# EAGLE design Bertha_v4_5 (EAGLE 8.0.1)
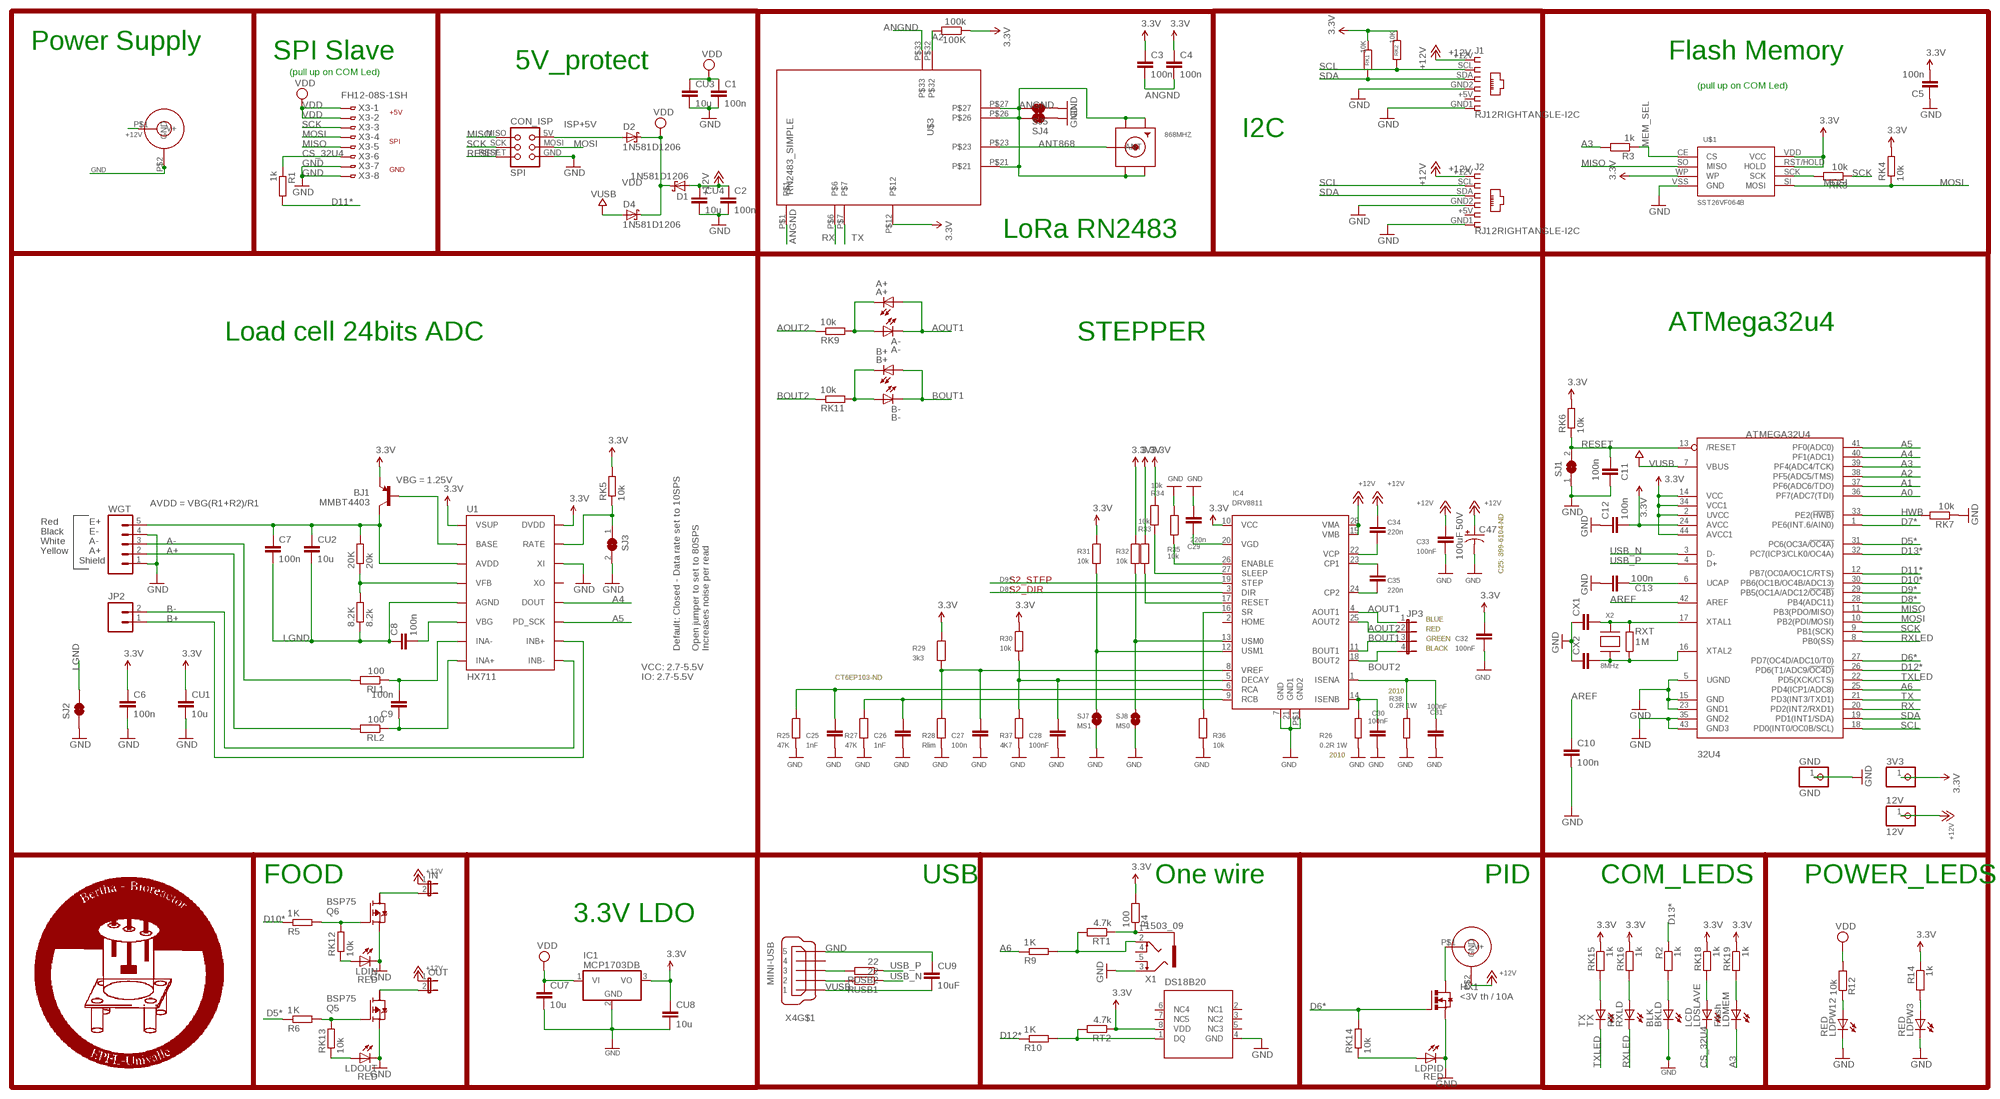
[diagram p0: schematic, sheet 1]

## Parts
3V3  PINHD-1X1  [1X01]
8.2K  8.2k  R-EU_M0805  [M0805]
12V  12V  PINHD-1X1  [1X01]
20K  20k  R-EU_M0805  [M0805]
32U4  ATMEGA32U4  ATMEGA32U4-AU  [TQFP44]
100K  100k  R-EU_R0805  [R0805]
868MHZ  SMACONNECTOR_EDGE  [SMA_EDGELAUNCH]
A+  A+  LEDCHIP-LED0805  [CHIP-LED0805]
A-  A-  LEDCHIP-LED0805  [CHIP-LED0805]
B+  B+  LEDCHIP-LED0805  [CHIP-LED0805]
B-  B-  LEDCHIP-LED0805  [CHIP-LED0805]
BJ1  MMBT4403  TRANSISTOR_PNPMMBT4403  [SOT23-3]
BKLD  BLK  LEDCHIP-LED0805  [CHIP-LED0805]
C1  100n  C-EUC0805  [C0805]
C2  100n  C-EUC0805  [C0805]
C3  100n  C-EUC0805  [C0805]
C4  100n  C-EUC0805  [C0805]
C5  100n  C-EUC0805  [C0805]
C6  100n  C-EUC0805  [C0805]
C7  100n  C-EUC0805  [C0805]
C8  100n  C-EUC0805  [C0805]
C9  100n  C-EUC0805  [C0805]
C10  100n  C-EUC0805  [C0805]
C11  100n  C-EUC0805  [C0805]
C12  100n  C-EUC0805  [C0805]
C13  100n  C-EUC0805  [C0805]
C25  1nF  CAP0805  [0805]
C26  1nF  CAP0805  [0805]
C27  100n  CAP0805  [0805]
C28  100nF  CAP0805  [0805]
C29  220n  CAP0805  [0805]
C30  100nF  CAP0805  [0805]
C31  100nF  CAP0805  [0805]
C32  100nF  CAP0805  [0805]
C33  100nF  CAP0805  [0805]
C34  220n  CAP0805  [0805]
C35  220n  CAP0805  [0805]
C47  100uF 50V  CAP_POLE  [PANASONIC_E]
CON1  JACK_DC_BARREL  [DC_BARREL]
CON2  JACK_DC_BARREL  [DC_BARREL]
CON_ISP  SPI  TINYISPT  [TC2030-MCP-NL]
CU1  10u  C-EUC0805  [C0805]
CU2  10u  C-EUC0805  [C0805]
CU3  10u  C-EUC0805  [C0805]
CU4  10u  C-EUC0805  [C0805]
CU7  10u  C-EUC0805  [C0805]
CU8  10u  C-EUC0805  [C0805]
CU9  10uF  C-EUC0805  [C0805]
CX1  22pF  C-EUC0805  [C0805]
CX2  22pF  C-EUC0805  [C0805]
D1  1N581D1206  [LED-1206]
D2  1N581D1206  [LED-1206]
D4  1N581D1206  [LED-1206]
GND  GND  PINHD-1X1  [1X01]
HX1  <3V th / 10A  IRF3704S  [D2PACK]
IC1  MCP1703DB  [SOT223]
IC4  DRV8811  [HTSSOP28]
IN  JP1E  [JP1]
J1  RJ12RIGHTANGLE-I2C  [RJ12-RIGHTANGLE-I2C]
J2  RJ12RIGHTANGLE-I2C  [RJ12-RIGHTANGLE-I2C]
JP2  M02PTH  [1X02]
JP3  JP4E  [JP4]
LDIN  RED  LEDCHIP-LED0805  [CHIP-LED0805]
LDMEM  Flash  LEDCHIP-LED0805  [CHIP-LED0805]
LDOUT  RED  LEDCHIP-LED0805  [CHIP-LED0805]
LDPID  RED  LEDCHIP-LED0805  [CHIP-LED0805]
LDPW3  RED  LEDCHIP-LED0805  [CHIP-LED0805]
LDPW12  RED  LEDCHIP-LED0805  [CHIP-LED0805]
LDSLAVE  LCD  LEDCHIP-LED0805  [CHIP-LED0805]
OUT  JP1E  [JP1]
Q5  BSP75  BSP613P  [PG-SOT-223]
Q6  BSP75  BSP613P  [PG-SOT-223]
R1  1k  R-EU_R0805  [R0805]
R2  1k  R-EU_R0805  [R0805]
R3  1k  R-EU_R0805  [R0805]
R4  100  R-EU_R0805  [R0805]
R5  1K  R-EU_R0805  [R0805]
R6  1K  R-EU_R0805  [R0805]
R9  1K  R-EU_R0805  [R0805]
R10  1K  R-EU_R0805  [R0805]
R12  10k  R-EU_R0805  [R0805]
R14  1k  R-EU_R0805  [R0805]
R25  47K  RESISTOR0805  [0805]
R26  0.2R 1W  R-EU_R2010  [R2010]
R27  47K  RESISTOR0805  [0805]
R28  Rlim  RESISTOR0805  [0805]
R29  3k3  RESISTOR0805  [0805]
R30  10k  RESISTOR0805  [0805]
R31  10k  RESISTOR0805  [0805]
R32  10k  RESISTOR0805  [0805]
R33  10k  RESISTOR0805  [0805]
R34  10k  RESISTOR0805  [0805]
R35  10k  RESISTOR0805  [0805]
R36  10k  RESISTOR0805  [0805]
R37  4K7  RESISTOR0805  [0805]
R38  0.2R 1W  R-EU_R2010  [R2010]
RK1  10K  R-EU_M0805  [M0805]
RK2  10K  R-EU_M0805  [M0805]
RK3  10k  R-EU_R0805  [R0805]
RK4  10k  R-EU_R0805  [R0805]
RK5  10k  R-EU_M0805  [M0805]
RK6  10k  R-EU_M0805  [M0805]
RK7  10k  R-EU_M0805  [M0805]
RK9  10k  R-EU_R0805  [R0805]
RK11  10k  R-EU_R0805  [R0805]
RK12  10k  R-EU_R0805  [R0805]
RK13  10k  R-EU_R0805  [R0805]
RK14  10k  R-EU_R0805  [R0805]
RK15  1k  R-EU_R0805  [R0805]
RK16  1k  R-EU_R0805  [R0805]
RK18  1k  R-EU_R0805  [R0805]
RK19  1k  R-EU_R0805  [R0805]
RL1  100  R-EU_M0805  [M0805]
RL2  100  R-EU_M0805  [M0805]
RT1  4.7k  R-EU_R0805  [R0805]
RT2  4.7k  R-EU_R0805  [R0805]
RUSB1  22  R-EU_M0805  [M0805]
RUSB2  22  R-EU_M0805  [M0805]
RXLD  RX  LEDCHIP-LED0805  [CHIP-LED0805]
RXT  1M  R-EU_R0805  [R0805]
SJ1  SJ  [SJ]
SJ2  JUMPER-PAD-2-NC_BY_TRACE  [PAD-JUMPER-2-NC_BY_TRACE_YES_SILK]
SJ3  SJ  [SJ]
SJ4  JUMPER-PAD-2-NC_BY_TRACE  [PAD-JUMPER-2-NC_BY_TRACE_YES_SILK]
SJ5  JUMPER-PAD-2-NC_BY_TRACE  [PAD-JUMPER-2-NC_BY_TRACE_YES_SILK]
SJ7  MS1  SJ  [SJ]
SJ8  MS0  SJ  [SJ]
TX  TX  LEDCHIP-LED0805  [CHIP-LED0805]
U1  HX711  HX711HX711  [SO16]
U$1  SST26VF064B  SST25VF064C  [SOIC_8-LEAD]
U$2  DS18B20  DS18B20SMALL  [MSOP8]
U$3  RN2483_SIMPLE  [RN2483_SIMPLE]
WGT  M05PTH  [1X05]
X1  1503_09  [1503_09]
X2  8MHz  XTALNX6035  [NX6035]
X3  FH12-08S-1SH  [FH12-08S-1SH]
X4  MINI-USB  MINI-USB-SCHIELD-32005-201  [32005-201]

## Nets
3.3V [power]: 3V3.1 32U4.2(UVCC) 32U4.14(VCC) 32U4.24(AVCC) 32U4.34(VCC1) 32U4.44(AVCC1) 100K.1 BJ1.2(E) C3.1 C4.1 C5.2 C6.1 C12.2 C32.1 CU1.1 CU8.1 IC1.3(VO) IC4.10(VCC) R4.2 R14.1 R29.2 R30.2 R31.2 R32.2 R33.2 R34.2 RK1.1 RK2.1 RK4.2 RK5.2 RK6.2 RK15.1 RK16.1 RK18.1 RK19.1 RT2.1 U1.1(VSUP) U1.16(DVDD) U$1.RST/HOLD(HOLD) U$1.VDD(VCC) U$1.WP U$2.8(VDD) U$3.P$12
+12V [power]: 12V.1 C2.1 C33.1 C34.1 C47.+ CON1.P$1(V+) CON2.P$2(GND) CU4.1 D1.A IC4.15(VMB) IC4.28(VMA) IN.1 J1.+12V J2.+12V OUT.1
A0: 32U4.36(PF7(ADC7(TDI))
A1: 32U4.37(PF6(ADC6/TDO))
A2: 32U4.38(PF5(ADC5/TMS)) 100K.2 U$3.P$32
A3: 32U4.39(PF4(ADC4/TCK)) LDMEM.C R3.2
A4: 32U4.40(PF1(ADC1)) U1.12(DOUT)
A5: 32U4.41(PF0(ADC0)) U1.11(PD_SCK)
A6: 32U4.25(PD4(ICP1/ADC8)) R9.1
A+: RL2.2 WGT.2
A-: RL1.2 WGT.3
ANGND: 868MHZ.GND@1(GND4) 868MHZ.GND@2(GND3) 868MHZ.GND@3(GND2) 868MHZ.GND@4(GND1) C3.2 C4.2 SJ4.2 SJ5.2 U$3.P$1 U$3.P$21 U$3.P$26 U$3.P$27 U$3.P$33
ANT868: 868MHZ.P(ANT) U$3.P$23
AOUT1: A+.A A-.C IC4.4(AOUT1) JP3.1
AOUT2: IC4.25(AOUT2) JP3.2 RK9.1
AREF: 32U4.42(AREF) C10.1
B+: JP2.1 U1.10(INB+)
B-: JP2.2 U1.9(INB-)
BOUT1: B+.A B-.C IC4.11(BOUT1) JP3.3
BOUT2: IC4.18(BOUT2) JP3.4 RK11.1
CN3: C8.2 U1.6(VBG)
CS_32U4: LDSLAVE.C R1.1 X3.6
D5*: 32U4.31(PC6(OC3A/!OC4A)) R6.1
D6*: 32U4.27(PD7(OC4D/ADC10/T0)) HX1.1(G) RK14.2
D7*: 32U4.1(PE6(INT.6/AIN0))
D8*: 32U4.28(PB4(ADC11)) IC4.3(DIR)
D9*: 32U4.29(PB5(OC1A/ADC12/!OC4B)) IC4.19(STEP)
D10*: 32U4.30(PB6(OC1B/OC4B/ADC13)) R5.1
D11*: 32U4.12(PB7(OC0A/OC1C/RTS)) R1.2
D12*: 32U4.26(PD6(T1/ADC9/!OC4D)) R10.1
D13*: 32U4.32(PC7(ICP3/CLK0/OC4A)) R2.1
GND [power]: 32U4.5(UGND) 32U4.15(GND) 32U4.23(GND1) 32U4.35(GND2) 32U4.43(GND3) BKLD.C C1.2 C2.2 C5.1 C6.2 C10.2 C11.2 C12.1 C13.1 C25.2 C26.2 C27.2 C28.2 C29.2 C30.2 C31.2 C32.2 C33.2 C47.- CON1.P$2(GND) CON_ISP.GND CU1.2 CU3.2 CU4.2 CU7.2 CU8.2 CU9.1 CX1.1 CX2.1 GND.1 HX1.3(S) IC1.2(GND) IC4.7(GND) IC4.21(GND1) IC4.P$1(GND2) J1.GND1 J1.GND2 J2.GND1 J2.GND2 LDIN.C LDOUT.C LDPID.C LDPW3.C LDPW12.C Q5.3(S) Q6.3(S) R25.1 R26.1 R27.1 R28.1 R35.1 R36.1 R37.1 R38.1 RK7.1 SJ1.1 SJ2.1 SJ3.2 SJ4.1 SJ5.1 SJ7.1 SJ8.1 U1.14(XI) U$1.VSS(GND) U$2.4(GND) WGT.1 WGT.4 X1.3 X3.7 X3.8 X4.5
HWB: 32U4.33(PE2(!HWB)) RK7.2
ISP+5V: CON_ISP.5V(VCC) D2.A
LGND: 8.2K.1 C7.2 C8.1 CU2.2 SJ2.2 U1.5(AGND)
MEM_SEL: R3.1 U$1.CE(CS)
MISO: 32U4.11(PB3(PDO/MISO)) CON_ISP.MISO U$1.SO(MISO) X3.5
MOSI: 32U4.10(PB2(PDI/MOSI)) CON_ISP.MOSI RK4.1 U$1.SI(MOSI) X3.4
N$1: 32U4.6(UCAP) C13.2
N$2: CON2.P$1(V+) HX1.2(D)
N$3: BKLD.A R2.2
N$5: 20K.2 BJ1.3(C) C7.1 CU2.1 U1.3(AVDD) WGT.5
N$7: LDPW12.A R12.1
N$8: Q6.1(G) R5.2 RK12.2
N$9 [power]: R10.2 RT2.2 U$2.1(DQ)
N$11: Q5.1(G) R6.2 RK13.2
N$12: C35.2 IC4.24(CP2)
N$13: OUT.2 Q5.2(D)
N$14 [power]: R4.1 RT1.1 X1.1
N$15: A+.C A-.A RK9.2
N$17: IN.2 Q6.2(D)
N$18: RK15.2 TX.A
N$19: B+.C B-.A RK11.2
N$20: C9.2 RL1.1 U1.7(INA-)
N$21 [power]: R9.2 RT1.2 X1.2
N$22: LDSLAVE.A RK18.2
N$23: RK3.2 U$1.SCK
N$24: RK16.2 RXLD.A
N$25: LDMEM.A RK19.2
N$26 [power]: LDPID.A RK14.1
N$27: LDIN.A RK12.1
N$28: LDOUT.A RK13.1
N$29: C35.1 IC4.23(CP1)
N$30: C34.2 IC4.22(VCP)
N$34: LDPW3.A R14.2
N$35: C29.1 IC4.20(VGD)
N$36: C31.1 IC4.1(ISENA) R38.2
N$38: BJ1.1(B) U1.2(BASE)
N$39: 8.2K.2 20K.1 U1.4(VFB)
N$40: C30.1 IC4.14(ISENB) R26.2
N$41: RK5.1 SJ3.1 U1.15(RATE)
N$42: 32U4.17(XTAL1) CX1.2 RXT.2 X2.P$2
N$43: C9.1 RL2.1 U1.8(INA+)
N$44: C28.1 IC4.5(DECAY) R30.1 R37.2
N$45: C25.1 IC4.6(RCA) R25.2
N$46: C26.1 IC4.9(RCB) R27.2
N$47: IC4.27(SLEEP) R34.1
N$48: IC4.17(RESET) R33.1
N$49: C27.1 IC4.8(VREF) R28.2 R29.1
N$50: IC4.26(ENABLE) R35.2
N$51: IC4.12(USM1) R31.1 SJ7.2
N$53: IC4.13(USM0) R32.1 SJ8.2
N$54: IC4.16(SR) R36.2
RESET: 32U4.13(/RESET) C11.1 CON_ISP.RESET RK6.1 SJ1.2
RX: 32U4.20(PD2(INT2/RXD1)) U$3.P$6
RXLED: 32U4.8(PB0(SS)) RXLD.C
SCK: 32U4.9(PB1(SCK)) CON_ISP.SCK RK3.1 X3.3
SCL: 32U4.18(PD0(INT0/OC0B/SCL)) J1.SCL J2.SCL RK2.2
SDA: 32U4.19(PD1(INT1/SDA)) J1.SDA J2.SDA RK1.2
TX: 32U4.21(PD3(INT3/TXD1)) U$3.P$7
TXLED: 32U4.22(PD5(XCK/CTS)) TX.C
USB_N: 32U4.3(D-) RUSB1.1
USB_P: 32U4.4(D+) RUSB2.1
USBC_N: RUSB1.2 X4.2
USBC_P: RUSB2.2 X4.3
VDD [power]: C1.1 CU3.1 CU7.1 D1.C D2.C D4.C IC1.1(VI) R12.2 X3.1 X3.2
VUSB: 32U4.7(VBUS) CU9.2 D4.A X4.1
XTAL1: 32U4.16(XTAL2) CX2.2 RXT.1 X2.P$1
Unconnected: IC4.2(HOME) Q5.4(D) Q6.4(D) U1.13(XO) U$2.2(NC1) U$2.3(NC2) U$2.5(NC3) U$2.6(NC4) U$2.7(NC5) X1.4 X1.5 X4.4 X4.M1(S:S1) X4.M2(S:S2) X4.M3(S:S3) X4.M4(S:S4)

## Notes on the sheet
- Power Supply
- SPI Slave | Flash Memory
- 5V_protect
- (pull up on COM Led)
- (pull up on COM Led)
- +5V
- I2C
- SPI
- GND
- LoRa RN2483
- ATMega32u4
- Load cell 24bits ADC | STEPPER
- VBG = 1.25V
- AVDD = VBG(R1+R2)/R1
- Red | E+
- Black | E-
- White | A-
- Yellow | A+
- Shield
- C25: 399-6104-ND
- S2_STEP
- S2_DIR
- BLUE
- RED
- GREEN
- Default: Closed - Data rate set to 10SPS
- Open jumper to set to 80SPS
  Increases noise per read
- BLACK
- VCC: 2.7-5.5V
- IO: 2.7-5.5V | CT6EP103-ND
- 2010
- 2010
- FOOD | USB | One wire | PID | COM_LEDS | POWER_LEDS
- 3.3V LDO

## Power pins joined to a net without a drawn wire
5: J1.+5V J2.+5V

## Library data of the parts
3V3 12V GND = Headerlibrary:PINHD-1X1: PIN HEADER
8.2K 20K R14 RK1 RK2 RK5-RK7 RL1 RL2 RT1 RT2 RUSB1 RUSB2 = resistor:R-EU_: RESISTOR, European symbol
32U4 = adafruit:ATMEGA32U4: http://www.ladyada.net/library/eagle
100K R1-R6 R9 R10 R12 R26 R38 RK3 RK4 RK9 RK11-RK16 RK18 RK19 RXT = rcl:R-EU_: RESISTOR, European symbol
868MHZ = sma_end_launch:SMACONNECTOR: SMA Connector 90° DIP SMA Connector, 50 Ohm (4UConnector: 07259)
A+ A- B+ B- BKLD LDIN LDMEM LDOUT LDPID LDPW3 LDPW12 LDSLAVE RXLD TX = adafruit:LED: LED OSRAM: - CHIPLED LG R971, LG N971, LY N971, LG Q971, LY Q971, LO R971, LY R971 LH N974, LH R974 LS Q976, LO Q976, LY Q976 LO Q996 - Hyper CHIPLED LW Q18S LB Q993, LB Q99A, LB R99A - SideLED LS A670, LO A670, LY A670, LG A670, LP A670 LB A673, LV A673, LT A673, LW A673 LH A674 LY A675 LS A676, LA A676, LO A676, LY A676, LW A676 LS A679, LY A679, LG A679 - Hyper Micro SIDELED® LS Y876, LA Y876, LO Y876, LY Y876 LT Y87S - SmartLED LW L88C, LW L88S LB L89C, LB L89S, LG L890 LS L89K, LO L89K, LY L89K LS L896, LA L896, LO L896, LY L896 - TOPLED LS T670, LO T670, LY T670, LG T670, LP T670 LSG T670, LSP T670, LSY T670, LOP T670, LYG T670 LG T671, LOG T671, LSG T671 LB T673, LV T673, LT T673, LW T673 LH T674 LS T676, LA T676, LO T676, LY T676, LB T676, LH T676, LSB T676, LW T676 LB T67C, LV T67C, LT T67C, LS T67K, LO T67K, LY T67K, LW E67C LS E67B, LA E67B, LO E67B, LY E67B, LB E67C, LV E67C, LT E67C LW T67C LS T679, LY T679, LG T679 LS T770, LO T770, LY T770, LG T770, LP T770 LB T773, LV T773, LT T773, LW T773 LH T774 LS E675, LA E675, LY E675, LS T675 LS T776, LA T776, LO T776, LY T776, LB T776 LHGB T686 LT T68C, LB T68C - Hyper Mini TOPLED® LB M676 - Mini TOPLED Santana® LG M470 LS M47K, LO M47K, LY M47K Source: http://www.osram.convergy.de/
BJ1 = SparkFun-DiscreteSemi:TRANSISTOR_PNP: Generic PNP BJT Double check pinouts against datasheets- not all devices are the same! MMBT3906 - 40V 200mA SOT-23 (TRANS-08052) MMBT4403 - 40V 600mA SOT-23 (TRANS-09245); PROD_ID: TRANS-09245
C1-C13 CU1-CU4 CU7-CU9 CX1 CX2 = rcl:C-EU: CAPACITOR, European symbol
C25-C35 = freetronics-master-v1:CAP: Capacitor Standard 0603 ceramic capacitor, and 0.1" leaded capacitor.
C47 = freetronics-original:CAP_POL: Capacitor Polarized These are standard SMD and PTH capacitors. Normally 10uF, 47uF, and 100uF in electrolytic and tantalum varieties. Always verify the external diameter of the through hole cap, it varies with capacity, voltage, and manufacturer. The EIA devices should be standard.
CON1 CON2 = lpatiny:JACK_DC_BARREL
CON_ISP = lpatiny:TINYISP: CONNECTOR
D1 D2 D4 = lpatiny:1N581*: 1.0A SCHOTTKY BARRIER RECTIFIER Source: http://www.diodes.com/datasheets/ds23001.pdf
HX1 = transistor-power:IRF3704: SMPS MOSFET HEXFET® Power MOSFET Source: http://www.irf.com/product-info/datasheets/data/irf3704.pdf
IC1 = linear:MCP1703: 250 mA, 16V, Low Quiescent Current LDO Regulator Source: http://ww1.microchip.com/downloads/en/DeviceDoc/22049b.pdf
IC4 = eje-components:DRV8811
IN OUT = jumper:JP1E: JUMPER
J1 J2 = lpatiny:RJ12: CORCOM Modular RJ Jacks No Shield Source: www.tycoelectronics.com .. ENG_DS_1654001_1099_RJ_L_0507.pdf
JP2 = SparkFun-Connectors:M02: Standard 2-pin 0.1" header. Use with - straight break away headers ( PRT-00116) - right angle break away headers (PRT-00553) - swiss pins (PRT-00743) - machine pins (PRT-00117) - female headers (PRT-00115) Molex polarized connector foot print use with: PRT-08233 with associated crimp pins and housings. 2.54_SCREWTERM for use with PRT-10571. 3.5mm Screw Terminal footprints for PRT-08084 5mm Screw Terminal footprints for use with PRT-08432
JP3 = jumper:JP4E: JUMPER
Q5 Q6 = infineon:BSP613P: SIPMOS (R) Small-Signal-Transistor P-Channel (2 Drain) Source: http://www.infineon.com/dgdl/BSP613P_Rev2.4.pdf; OC_FARNELL: unknown; OC_NEWARK: unknown
R25 R27-R37 = freetronics-master-v1:RESISTOR: Resistor Basic schematic elements and footprints for 0603, 1206, and PTH 1/10th watt (small) resistors.
SJ1 SJ3 = jumper:SJ: SMD solder JUMPER
SJ2 SJ4 SJ5 = SparkFun-Passives:JUMPER-PAD-2-NC_BY_TRACE
SJ7 SJ8 = freetronics-luke:SJ: PCB "solder jumper". Note that there should nothing on the BOM corresponding to this "component".
U1 = Testing:HX711; PROD_ID: IC-12445
U$1 = BertaLib:SST25VF064C
U$2 = lpatiny:DS18B20
U$3 = Octanis1_bioreactorPort:RN2483_SIMPLE
WGT = SparkFun-Connectors:M05: Header 5 Standard 5-pin 0.1" header. Use with straight break away headers (SKU : PRT-00116), right angle break away headers (PRT-00553), swiss pins (PRT-00743), machine pins (PRT-00117), and female headers (PRT-00115). Molex polarized connector foot print use with SKU : PRT-08230 with associated crimp pins and housings.
X1 = con-lumberg:1503_09: Jack connectors according to JISC 6560, 3.5 mm Klinkeneinbaukupplung nach JISC 6560, 3,5 mm, 3-polig/ stereo, abgewinkelte Ausführung, mit 2 Öffnern und Lötaugen, für Leiterplatten Rückseitenmontage Source: http://www.lumberg.com/Produkte/PDFs/1503_09.pdf; OC_FARNELL: 1243244; OC_NEWARK: unknown
X2 = lpatiny:XTAL: Low cost SMT crystals, no capacitors included http://www.ladyada.net/library/eagle
X3 = con-hirose:FH12-08S-1S: 1mm Pitch Connectors For FPC/FFC Source: Data sheet <http://www.hirose.co.jp/cataloge_hp/e58605370.pdf>; OC_FARNELL: unknown; OC_NEWARK: unknown
X4 = con-cypressindustries:MINI-USB-SCHIELD-: MINI USB-B Conector Source: www.cypressindustries.com; OC_FARNELL: unknown; OC_NEWARK: unknown

## Net classes
0 default: width 0.203 mm, clearance 0.25 mm
1 power: width 0.203 mm, drill 0.305 mm, clearance 0.25 mm
2 VIN: width 0.457 mm, clearance 0.25 mm
3 fine: width 0.254 mm, clearance 0.25 mm
4 aref: width 0.356 mm, clearance 0.25 mm

## Board
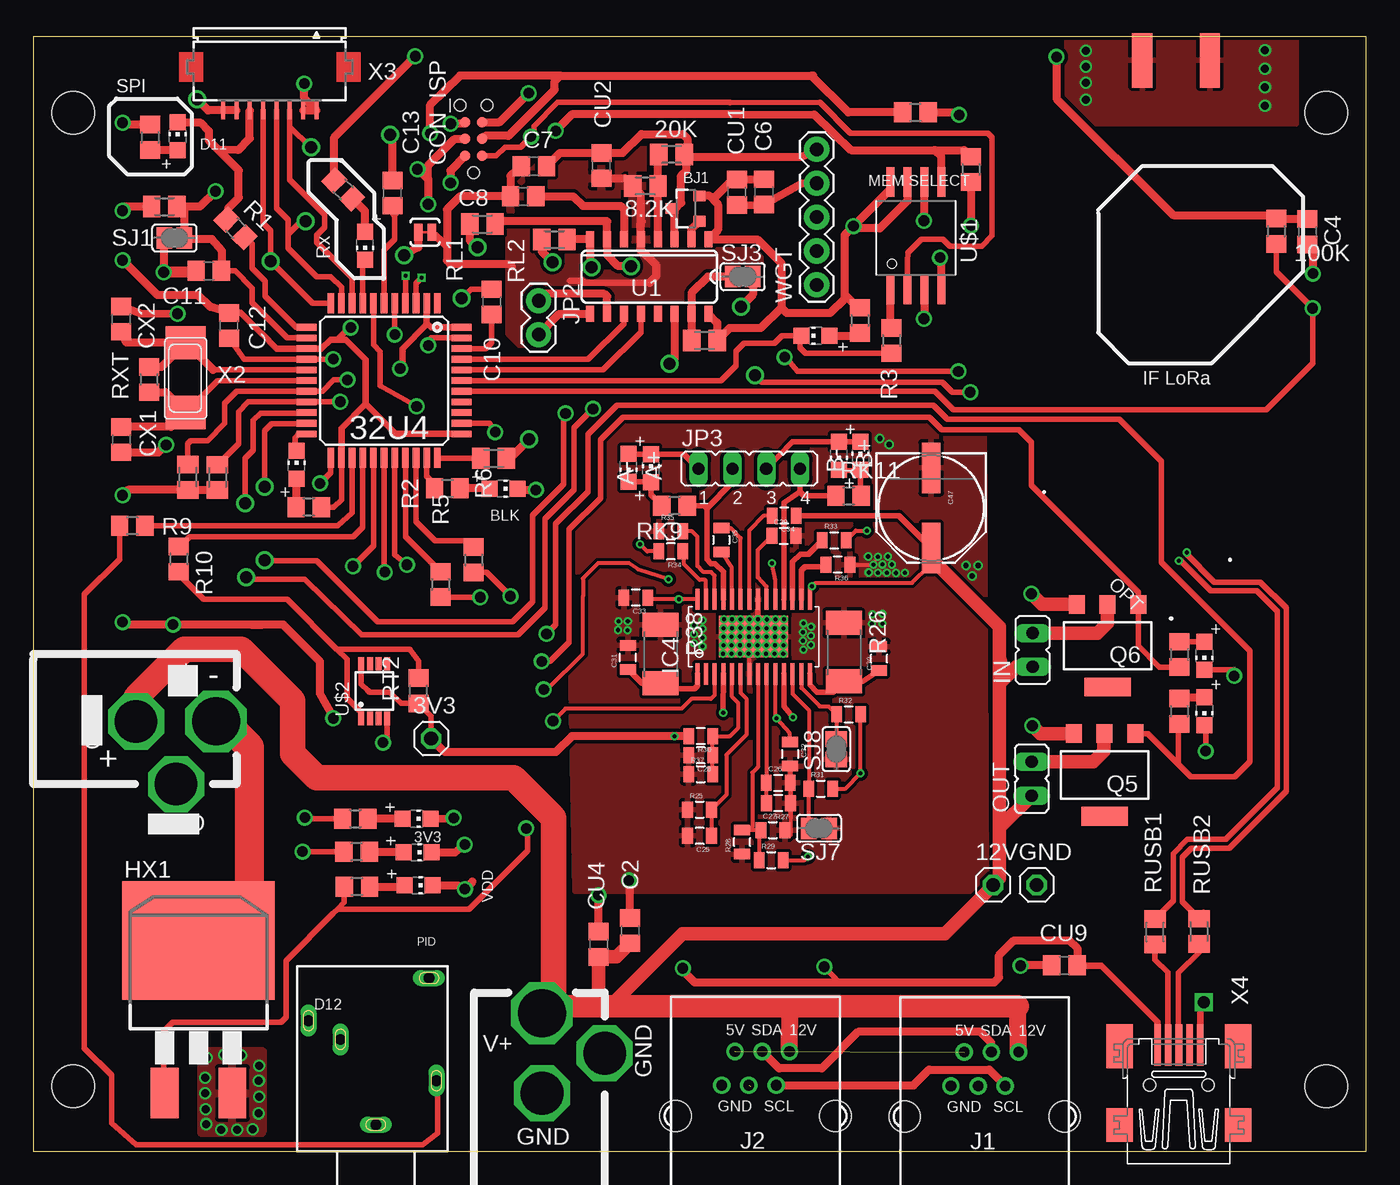
[diagram p1: board, top side]
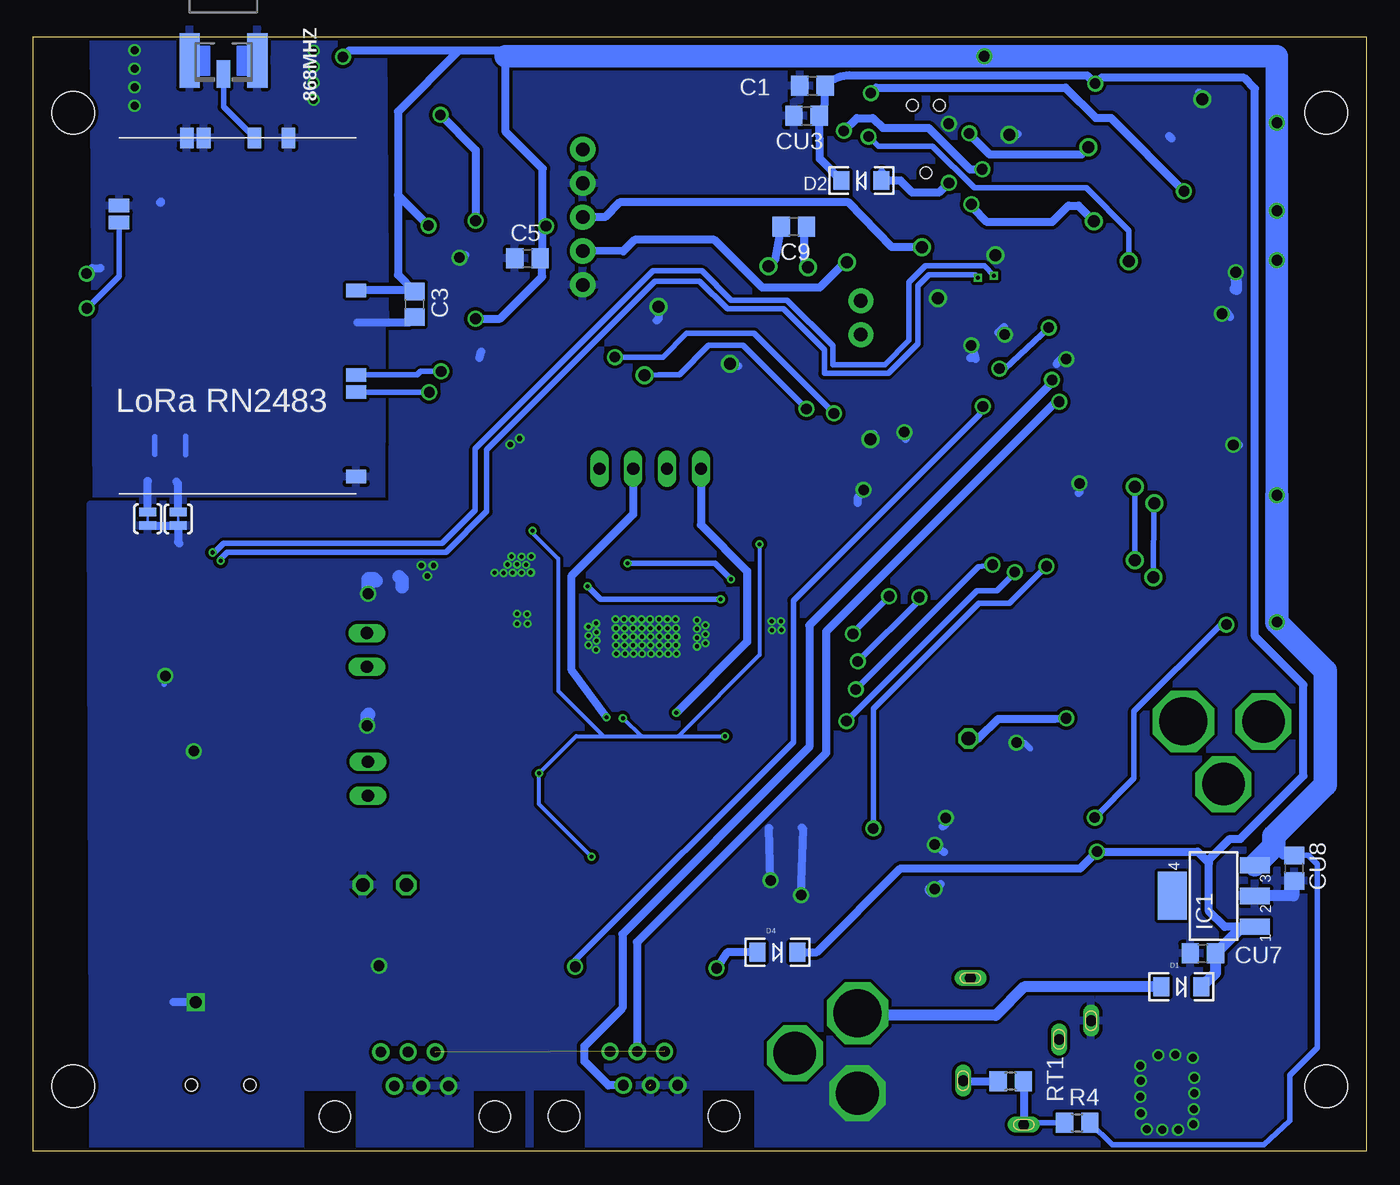
[diagram p2: board, bottom side, seen from below]

Size 100 x 83.6 mm. Coordinates in mm from the lower left corner, seen from the top.
Outline: 0,0 100,0 100,83.6 0,83.6 0,0
Copper layers (1*2*15*16): Top 0.035mm / dielectric 0.2mm / layer 2 0.0175mm / dielectric 1.1mm / layer 15 0.0175mm / dielectric 0.2mm / Bottom 0.035mm
Design rules "SeeedStudio_DRU_no_angle_20130527": minimum track width 6mil, minimum drill 12mil, track to track 6mil, track to pad 6mil, pad to pad 6mil, via to via 6mil, smd to smd 0mil, copper to edge 10mil, drill to drill 10mil, minimum pad ring 6mil, minimum via ring 6mil, stop-mask expansion 2mil, vias tented up to drill 25mil, thermal gap 10mil
Holes 3.2 mm at 3,77.9 97,77.9 3,4.9 97,4.9
vRestrict: area 13.7,77 to 21.9,80.8

### Footprints (pad centres in the part's own frame; a part is rotated, then mirrored left to right if it is on the bottom)
1X01 = drill 1.016 octagon: 1 0,0
M0805 = smd 1.3 x 1.6: 1 -0.95,0; 2 0.95,0
TQFP44 = smd 1.5 x 0.5: 1 -5.8,4; 2 -5.8,3.2; 3 -5.8,2.4; 4 -5.8,1.6; 5 -5.8,0.8; 6 -5.8,0; 7 -5.8,-0.8; 8 -5.8,-1.6; 9 -5.8,-2.4; 10 -5.8,-3.2; 11 -5.8,-4; 23 5.8,-4; 24 5.8,-3.2; 25 5.8,-2.4; 26 5.8,-1.6; 27 5.8,-0.8; 28 5.8,0; 29 5.8,0.8; 30 5.8,1.6; 31 5.8,2.4; 32 5.8,3.2; 33 5.8,4 | smd 0.5 x 1.5: 12 -4,-5.8; 13 -3.2,-5.8; 14 -2.4,-5.8; 15 -1.6,-5.8; 16 -0.8,-5.8; 17 0,-5.8; 18 0.8,-5.8; 19 1.6,-5.8; 20 2.4,-5.8; 21 3.2,-5.8; 22 4,-5.8; 34 4,5.8; 35 3.2,5.8; 36 2.4,5.8; 37 1.6,5.8; 38 0.8,5.8; 39 0,5.8; 40 -0.8,5.8; 41 -1.6,5.8; 42 -2.4,5.8; 43 -3.2,5.8; 44 -4,5.8
R0805 = smd 1.3 x 1.5: 1 -0.95,0; 2 0.95,0
SMA_EDGELAUNCH_UFL = smd 4.064 x 1.524: GND@1 2.032,-2.54; GND@2 2.032,2.54 | smd 4.064 x 1.524 bottom: GND@3 2.032,2.54; GND@4 2.032,-2.54 | smd 2.032 x 1.016: P 3.048,0
CHIP-LED0805 = smd 1.2 x 1.2: A 0,-1.05; C 0,1.05
SOT23-3 = smd 0.8 x 0.9: 1 -0.95,-1; 2 0.95,-1; 3 0,1.1
C0805 = smd 1.3 x 1.5: 1 -0.95,0; 2 0.95,0
0805 = smd 0.8 x 1.2: 1 -0.9,0; 2 0.9,0
PANASONIC_E = smd 3.8 x 1.4: + 3,0; - -3,0
DC_BARREL = drill 3.6 pad 4.5 octagon: P$1 0,13.7 | drill 3.2 pad 4.064 octagon: P$2 0,7.7; P$3 4.7,10.7
TC2030-MCP-NL = smd 0.787 x 0.787: 5V 1.27,0.635; GND 3.81,0.635; MISO 1.27,-0.635; MOSI 2.54,0.635; RESET 3.81,-0.635; SCK 2.54,-0.635 | hole 0.889: 0,0; 5.08,-1.016; 5.08,1.016
LED-1206 = smd 1.2 x 1.4: A -1.5,0; C 1.5,0
D2PACK = smd 2.083 x 3.81: 1 -2.54,-8.89; 3 2.54,-8.89 | smd 11.43 x 8.89: 2 0,2.54
SOT223 = smd 1.219 x 2.235: 1 -2.311,-3.099; 2 0,-3.099; 3 2.311,-3.099 | smd 3.6 x 2.2: 4 0,3.099
HTSSOP28 = smd 0.3 x 1.6: 1 -4.225,-2.8; 2 -3.575,-2.8; 3 -2.925,-2.8; 4 -2.275,-2.8; 5 -1.625,-2.8; 6 -0.975,-2.8; 7 -0.325,-2.8; 8 0.325,-2.8; 9 0.975,-2.8; 10 1.625,-2.8; 11 2.275,-2.8; 12 2.925,-2.8; 13 3.575,-2.8; 14 4.225,-2.8; 15 4.225,2.8; 16 3.575,2.8; 17 2.925,2.8; 18 2.275,2.8; 19 1.625,2.8; 20 0.975,2.8; 21 0.325,2.8; 22 -0.325,2.8; 23 -0.975,2.8; 24 -1.625,2.8; 25 -2.275,2.8; 26 -2.925,2.8; 27 -3.575,2.8; 28 -4.225,2.8 | smd 5.18 x 3.1: P$1 0,0
JP1 = drill 0.914 long: 1 0,-1.27; 2 0,1.27
RJ12-RIGHTANGLE-I2C = drill 0.8 pad 1.3: +5V -1.54,4.84; +12V 2.54,4.84; GND1 -2.54,2.3; GND2 -0.5,2.3; SCL 1.54,2.3; SDA 0.5,4.84 | hole 2.36: -6,0; 6,0
1X02 = drill 1.016 pad 1.88: 1 0,0; 2 2.54,0
JP4 = drill 0.914 long: 1 -3.81,0; 2 -1.27,0; 3 1.27,0; 4 3.81,0
PG-SOT-223 = smd 1.2 x 1.4: 1 -2.311,-3.099; 2 0,-3.099; 3 2.311,-3.099 | smd 3.5 x 1.4: 4 0,3.099
R2010 = smd 1.8 x 2.7: 1 -2.2,0; 2 2.2,0
SJ = smd 1.168 x 1.6: 1 -0.762,0; 2 0.762,0
PAD-JUMPER-2-NC_BY_TRACE_YES_SILK = smd 0.635 x 1.27: 1 -0.508,0; 2 0.508,0
SO16 = smd 0.6 x 1.2: 1 -4.445,-2.8; 2 -3.175,-2.8; 3 -1.905,-2.8; 4 -0.635,-2.8; 5 0.635,-2.8; 6 1.905,-2.8; 7 3.175,-2.8; 8 4.445,-2.8; 9 4.445,2.8; 10 3.175,2.8; 11 1.905,2.8; 12 0.635,2.8; 13 -0.635,2.8; 14 -1.905,2.8; 15 -3.175,2.8; 16 -4.445,2.8
SOIC_8-LEAD = smd 0.61 x 2.21: CE -1.905,-2.934; RST/HOLD -0.635,5.156; SCK 0.635,5.156; SI 1.905,5.156; SO -0.635,-2.934; VDD -1.905,5.156; VSS 1.905,-2.934; WP 0.635,-2.934
MSOP8 = smd 0.45 x 1: 1 -0.975,-2.05; 2 -0.325,-2.05; 3 0.325,-2.05; 4 0.975,-2.05; 5 0.975,2.05; 6 0.325,2.05; 7 -0.325,2.05; 8 -0.975,2.05
RN2483_SIMPLE = smd 1.524 x 1.016: P$1 8.89,-11.43; P$6 8.89,-5.08; P$7 8.89,-3.81; P$12 8.89,2.54; P$32 -8.89,7.62; P$33 -8.89,8.89 | smd 1.016 x 1.524: P$21 3.81,13.97; P$23 1.27,13.97; P$26 -2.54,13.97; P$27 -3.81,13.97
1X05 = drill 1.016 pad 1.88: 1 0,0; 2 2.54,0; 3 5.08,0; 4 7.62,0; 5 10.16,0
1503_09 = drill 0.8 pad 1.2 long: 1 0,-2.1; 2 -4.55,-5.4; 3 5.05,-9.9; 4 -4,-13.1; 5 2.65,-8.5
NX6035 = smd 2.5 x 3: P$1 2.665,0; P$2 -2.565,0
FH12-08S-1SH = smd 0.3 x 1.3: 1 -3.5,3.25; 2 -2.5,3.25; 3 -1.5,3.25; 4 -0.5,3.25; 5 0.5,3.25; 6 1.5,3.25; 7 2.5,3.25; 8 3.5,3.25
32005-201 = smd 3.1 x 0.5: 1 3,1.6; 2 3,0.8; 3 3,0; 4 3,-0.8; 5 3,-1.6 | smd 2.5 x 2: M1 -3,-4.45; M2 -3,4.45 | smd 3.3 x 2: M3 2.9,4.45; M4 2.9,-4.45 | hole 0.9: 0,2.2; 0,-2.2

### Placement (x,y rotation side)
3V3  29.84,30.97 0 top
8.2K  45.92,72.41 0 top
12V  72,19.99 0 top
20K  47.88,74.77 0 top
32U4  26.31,57.81 270 top
100K  93.25,69.01 270 top
868MHZ  [SMA_EDGELAUNCH_UFL]  85.73,83.85 270 bottom
A+  44.65,51.27 180 top
A-  46.34,51.25 0 top
B+  60.44,52.16 180 top
B-  62.07,52.18 0 top
BJ1  48.97,70.71 90 top
BKLD  35.29,49.7 270 top
C1  41.55,79.92 180 bottom
C2  44.78,16.56 90 top
C3  71.39,63.54 270 bottom
C4  95.59,68.97 270 top
C5  62.93,66.97 0 bottom
C6  54.82,71.96 270 top
C7  37.55,73.88 180 top
C8  36.76,71.63 0 top
C9  42.94,69.36 180 bottom
C10  34.4,63.71 90 top
C11  13.17,66.04 180 top
C12  14.68,61.93 90 top
C13  26.94,71.87 270 top
C25  49.98,23.66 180 top
C26  55.9,27.65 0 top
C27  55.49,24.1 0 top
C28  50.07,29.69 180 top
C29  56.32,46.16 0 top
C30  63.45,36.96 90 top
C31  44.61,37.05 90 top
C32  56.78,29.8 270 top
C33  45.21,41.53 180 top
C34  56.33,47.69 180 top
C35  51.62,45.86 270 top
C47  67.36,48.26 270 top
CON1  38.16,-3.34 0 top
CON2  0.01,32.24 270 top
CON_ISP  33.03,73.39 90 top
CU1  52.78,71.94 270 top
CU2  42.62,73.94 270 top
CU3  41.98,77.66 180 bottom
CU4  42.42,15.53 90 top
CU7  12.25,14.85 180 bottom
CU8  5.41,21.23 270 bottom
CU9  77.35,13.95 0 top
CX1  6.6,53.38 90 top
CX2  6.6,62.42 270 top
D1  13.85,12.34 0 bottom
D2  37.87,72.81 180 bottom
D4  44.16,14.94 0 bottom
GND  75.28,19.99 0 top
HX1  12.4,13.27 0 top
IC1  11.45,19.15 90 bottom
IC4  54.04,38.61 0 top
IN  74.97,37.61 0 top
J1  71.38,2.61 0 top
J2  54.19,2.66 0 top
JP2  37.91,63.8 270 top
JP3  53.72,51.2 0 top
LDIN  87.86,37.18 180 top
LDMEM  58.68,61.18 90 top
LDOUT  87.87,33.02 180 top
LDPID  28.89,19.95 270 top
LDPW3  28.76,24.94 270 top
LDPW12  28.82,22.43 270 top
LDSLAVE  10.83,76.12 0 top
OUT  74.9,27.95 0 top
Q5  80.37,28.24 180 top
Q6  80.59,37.93 180 top
R1  15.17,69.23 315 top
R2  31.05,49.72 0 top
R3  64.39,60.82 270 top
R4  21.68,2.16 0 bottom
R5  30.55,42.52 270 top
R6  33.05,44.37 270 top
R9  7.43,46.91 180 top
R10  10.92,44.42 270 top
R12  24.25,22.46 180 top
R14  24.16,24.95 0 top
R25  49.99,25.62 0 top
R26  60.81,37.45 270 top
R27  55.9,26.12 180 top
R28  53.17,23.19 90 top
R29  55.37,21.84 0 top
R30  50.08,31.15 180 top
R31  59.08,27.21 0 top
R32  61.16,32.77 0 top
R33  60.09,45.83 0 top
R34  47.84,45 180 top
R35  47.84,46.5 0 top
R36  60.36,44.01 180 top
R37  50.07,28.3 0 top
R38  47.06,37.3 270 top
RK1  13.82,50.55 90 top
RK2  11.6,50.56 90 top
RK3  66.18,77.93 0 top
RK4  70.35,73.64 270 top
RK5  50.36,60.81 0 top
RK6  9.84,70.86 180 top
RK7  34.54,51.98 180 top
RK9  48.11,48.42 180 top
RK11  61.16,49.17 0 top
RK12  86,37.28 270 top
RK13  85.97,33.01 270 top
RK14  24.28,19.85 180 top
RK15  20.67,48.32 180 top
RK16  23.25,72.15 315 top
RK18  8.76,76.06 270 top
RK19  62.03,62.32 270 top
RL1  33.7,69.55 180 top
RL2  39.09,68.39 180 top
RT1  26.67,5.25 180 bottom
RT2  28.9,34.54 90 top
RUSB1  84.16,16.47 270 top
RUSB2  87.47,16.5 270 top
RXLD  24.88,67.93 180 top
RXT  8.68,57.89 270 top
SJ1  10.59,68.5 0 top
SJ2  29.39,68.93 0 top
SJ3  53.22,65.61 0 top
SJ4  91.41,47.45 90 bottom
SJ5  89.13,47.44 90 bottom
SJ7  58.94,24.22 180 top
SJ8  60.25,30.17 90 top
TX  19.75,51.51 0 top
U1  46.22,65.61 180 top
U$1  66.22,67.56 0 top
U$2  25.58,34.52 0 top
U$3  84.68,62.04 0 bottom
WGT  58.78,64.99 90 top
X1  25.69,-0.1 180 top
X2  11.43,57.99 90 top
X3  17.75,81.33 180 top
X4  85.94,4.98 90 top

### Tracks (layer width: path | path; a pad name or v marks a point on that pad's centre or on a via)
3.3V  (via drill 0.3, 0.8, 0.8 pad 0.81)
  Top 0.305: R32.2 v62.07,28.35 60.94,27.21 R31.2 | C32.1 56.71,30.77 56.71,31.41 v55.77,32.48 55.66,32.59 IC4.10 | R29.2 57.87,21.84 v58.12,22.09 | R33.2 61.71,46.55 v62.53,46.55 | R34.2 46.06,45 v45.52,45.55
  Top 0.406: 20.53,60.21 32U4.14 | RK15.1 22.54,48.32 23.11,48.89 32U4.24 | U$2.8 24.59,36.54 24.59,35.05 25.09,34.58 25.23,34.44 26.73,34.44 27.58,33.59 RT2.1 29.84,32.65 3V3.1 | R14.1 20.46,24.95 v20.37,25.04
  Top 0.5: 24.93,56.06 23.11,54.24 32U4.24 | 24.93,56.06 24.93,59.39 23.44,60.88 22.81,60.88 | 22.81,60.88 22.3,60.88 21.58,60.21 20.53,60.21 | 32U4.34 27.18,53.81 24.93,56.06 | 32U4.44 29.83,61.81 29.52,62.12 | 32U4.2 29.52,62.12 | 29.52,62.12 29.52,62.02 27.7,60.2 27.7,58.89 v27.52,58.71 | 23.81,61.88 22.81,60.88 | 32U4.14 18.27,60.21 17.15,61.33 17.12,61.33 15.57,62.88 C12.2
  Top 0.61: v23.81,61.78 23.81,61.88 | 56.11,63.29 56.11,66.62 54.32,68.41 U1.1 51.36,69.1 51.36,71.05 51,71.42 | U1.16 51.31,62.16 RK5.2 52.26,61.76 54.59,61.76 56.11,63.29 | 51,71.42 50.75,71.66 BJ1.2 | 51,71.42 52.59,73.01 CU1.1 52.78,72.92 C6.1 | RK6.2 6.7,70.86 v6.7,70.55 | C12.2 13.27,63.33 12.38,64.22 9.32,64.22 v6.7,66.84 | RK18.1 6.7,77.01 v6.7,77.15 | v6.7,49.21 7.11,49.61 RK2.1 13.81,49.61 RK1.1 | RK16.1 22.58,76.06 v28.66,82.14 | v76.77,82.09 76.77,78.96 85.52,70.21 93.02,70.21 100K.1 95.55,69.97 C4.1 95.3,70.21 | 61.58,69.35 v61.53,69.39 | 16.33,39.51 17.2,39.51 | v22.5,32.49 22.5,32.61 21.51,34.34 21.51,36.73 18.75,39.51 16.35,39.51 16.33,39.51 | 16.33,39.51 v10.48,39.51 6.88,39.51 v6.7,39.69 | R30.2 v48.11,31.15 40.41,31.15 39.2,29.94 30.87,29.94 3V3.1 | 60.88,64.25 60.88,63.96 59.78,62.86 56.54,62.86 56.11,63.29 | 60.88,64.25 60.88,68.74 v61.53,69.39 | RK19.1 61.86,63.27 60.88,64.25 | U$1.VDD 64.31,72.17 v61.53,69.39 | U$1.RST/HOLD 65.59,71.3 63.52,69.23 61.7,69.23 v61.53,69.39 | U$1.WP 66.85,62.49 v66.82,62.45 | RK4.2 70.36,71.3 v70.36,69.43
  Bottom 0.203: CU8.1 5.61,22.17 5.77,22.18
  Bottom 0.305: v55.77,32.48 54.35,31.15 | 54.35,31.15 51.6,31.15 | 51.6,31.15 v48.11,31.15 | 57.22,31.15 59.27,31.15 v62.07,28.35 62.07,26.04 v58.12,22.09 | 57.22,31.15 54.35,31.15 | v62.53,46.55 62.53,46.37 60.61,44.45 60.61,34.54 57.22,31.15 | v45.52,45.55 45.52,37.23 51.6,31.15
  Bottom 0.406: CU8.1 5.4,22.19 4.36,22.19 3.69,21.52 3.69,7.77 5.74,5.71 5.74,2.28 7.69,0.49 19.06,0.49 R4.2 | v20.37,25.04 17.42,27.99 17.42,33.01 10.92,39.51 v10.48,39.51
  Bottom 0.5: v27.52,58.71 27.11,58.71 v23.81,61.78
  Bottom 0.61: 72.65,71.72 72.65,77.99 68.07,82.57 | 68.07,82.57 76.29,82.57 v76.77,82.09 76.95,82.06 | 64.36,82.14 64.59,81.9 64.59,76.51 61.79,73.71 61.79,69.39 | 62.77,82.14 63.2,82.57 68.07,82.57 | v61.53,69.39 61.79,69.39 | v22.5,32.49 23.39,32.42 27.62,32.42 29.08,30.97 3V3.1 | 5.77,22.18 6.23,22.18 6.93,22.88 | 61.79,69.39 61.79,67.15 C5.2 61.82,66.81 61.82,65.61 64.98,62.45 v66.82,62.45 | v70.36,69.43 72.65,71.72 | U$3.P$12 71.49,64.58 C3.1 72.65,65.74 72.65,71.72
  Bottom 1.676: v6.7,49.21 v6.7,66.84 v6.7,70.55 v6.7,77.15 6.7,82.14 v28.66,82.14 62.77,82.14 64.36,82.14 64.55,82.14 64.55,82.15 | IC1.3 6.93,22.88
  Bottom 1.778: 6.93,22.88 6.93,23.64 3.07,27.5 3.07,36.06 v6.7,39.69 v6.7,49.21
5  (1 unrouted)
+12V  (via drill 0.3)
  Top 0.305: IC4.15 58.26,42.23 v58.43,42.4 58.69,42.64 65.94,42.64 67.25,43.97 | IC4.28 v48.43,41.41 | v48.43,41.41 | v48.43,41.41 46.23,41.41 arc-90 C33.1
  Top 0.406: C34.1 64.93,47.69 C47.+ | 38.91,14.74 39.04,14.6
  Top 1.016: 72.49,36.86 72.49,39.34 67.87,43.97 67.25,43.97 67.25,45.16 C47.+ | 72.49,36.86 72.54,36.81 | 72.49,36.86 72.49,35.07 | 72.49,35.07 72.49,24.27 | 72.49,24.27 72.49,20.48 12V.1 72,19.94 68.38,16.32 48.69,16.32 43.27,10.89 | 41.83,10.89 42.42,11.48 CU4.1 43.75,14.58 C2.1 | OUT.1 72.49,24.27 | IN.1 73.76,36.34 72.49,35.07
  Top 1.27: J2.+12V 56.78,10.89 | J1.+12V 73.88,10.89
  Top 1.676: 73.88,10.89 56.78,10.89 43.27,10.89 41.83,10.89 38.8,10.89 38.8,10.64 38.69,10.64 38.16,10.64 CON1.P$1
  Top 1.93: CON2.P$2 7.71,34.04 11.34,37.67 15.58,37.67 19.46,33.79 19.46,29.81 21.25,28.03 36.04,28.03 39.04,25.03 39.04,14.6 39.04,11.24 CON1.P$1
  Top 2.184: 38.16,11.17 38.69,10.64
  Bottom 0.406: v48.43,41.41 57.44,41.41 v58.43,42.4
  Bottom 0.813: D1.A 25.66,12.34 27.8,10.21 38.14,10.21 38.63,10.7 38.5,10.7 CON1.P$1
A2  (via drill 0.8)
  Top 0.406: 32U4.38 32.12,57 51.03,57 | 100K.2 93.25,65.97 v95.98,63.23 95.98,59.11 92.51,55.64 69.02,55.64 68,56.65 | 51.03,57 51.22,57 | 68,56.65 67.7,56.95 | 51.03,57 67.65,57 68,56.65
  Bottom 0.406: U$3.P$32 93.57,65.64 95.96,63.25 v95.98,63.23
A3
  Top 0.406: 32U4.39 32.19,57.81 51.59,57.81 52.72,58.94 52.72,60.01 53.32,60.61 55.6,60.61 56.17,61.18 LDMEM.C 57.53,61.08 57.53,60.28 57.94,59.87 R3.2
A4
  Top 0.406: 32U4.40 42.76,58.61 45.58,61.43 U1.12
A5
  Top 0.406: U1.11 44.31,62.06 41.62,59.42 41.61,59.41 32U4.41
A6
  Top 0.406: 32U4.25 23.91,47.91 22.84,46.92 14.02,46.92 R9.1
A+  (via drill 0.9 pad 0.81)
  Top 0.61: RL2.2 38.14,67.5 v38.95,66.69
  Bottom 0.61: v38.95,66.69 39.09,66.69 41.01,64.78 45.31,64.78 46.83,66.3 | 46.83,66.3 | 46.83,66.3 48.9,68.37 54.88,68.37 55.74,67.5 WGT.2
A-  (via drill 0.9 pad 0.81)
  Top 0.61: RL1.2 32.75,68.3 v33.32,67.81
  Bottom 0.61: v33.32,67.81 35.6,67.82 38.83,71.18 56.02,71.18 57.12,70.07 WGT.3
ANGND  (via drill 0.6, 0.8)
  Top 0.61: C4.2 96,67.61 v96,65.84
  Bottom 0.406: 90.9,52.27 90.9,53.6 | 88.59,52.25 88.59,53.65
  Bottom 0.61: 90.49,71.16 arc-90 90.41,71.23 | 90.41,71.23 | SJ4.2 91.41,50.27 91.43,50.28 | SJ5.2 89.13,50.08 89.28,50.23 | v96,65.84 95.59,66.25 94.95,66.25 | C3.2 71.82,62.16 75.69,62.16
  other vias: 78.98,82.56 78.98,81.37 78.98,80.16 78.98,78.86 92.41,82.59 92.41,81.21 92.41,79.8 92.41,78.41
  pour Bottom (rank 2): 73.82,84.13 95.5,84.13 95.28,48.42 73.48,48.42 73.73,83.51
  pour Top: 77.61,83.62 94.75,83.62 94.75,77.06 77.55,77.06 77.55,83.59
ANT868
  Bottom 0.406: 868MHZ.P 85.73,78.34 U$3.P$23
  Bottom 0.61: U$3.P$23 83.31,76.11
AOUT1  (via drill 0.3)
  Top 0.406: v51.76,32.91 IC4.4 | A-.C 46.31,52.58 | A+.A 44.67,52.3 A-.C | JP3.1 48.8,52.3 A-.C
  Bottom 0.61: JP3.1 49.91,46.98 46.45,43.52 46.45,38.21 v51.76,32.91
AOUT2
  Top 0.406: IC4.25 51.76,43.46 51.14,44.09 50.84,44.09 50.53,44.4 50.53,48.25 | 50.53,48.25 52.43,50.15 52.43,51.18 JP3.2 | RK9.1 50.36,48.42 50.53,48.25
AREF
  Top 0.406: 32U4.42 33.93,60.21 33.94,60.2 34.4,60.65 C10.1
B+
  Top 0.61: U1.10 43.04,64.13 42.86,64.31 38.4,64.31 JP2.1
B-
  Top 0.61: JP2.2 39.46,62.81 U1.9
BOUT1  (via drill 0.3)
  Top 0.406: v57,32.56 56.32,33.4 IC4.11 | B-.C 60.41,53.24 B+.A 56.95,53.24 JP3.3
  Bottom 0.406: JP3.3
  Bottom 0.61: JP3.3 54.99,47.78 59.64,43.13 59.64,36.16 v57,32.56
BOUT2
  Top 0.406: IC4.18 56.31,48.65 57.53,49.46 | 57.53,49.46 JP3.4 | RK11.1 57.82,49.17 57.53,49.46
  Top 0.813: 57.53,51.28 JP3.4
CN3
  Top 0.61: 44.35,68.44 U1.6 44.33,68.43 44.33,70.63 44.06,70.91 41.23,70.91 40.5,71.63 C8.2
CS_32U4
  Top 0.61: 13.87,75.11 15.37,75.09 16.25,75.97 X3.6 | LDSLAVE.C 12.5,77.17 13.16,76.51 13.16,75.83 13.87,75.11 | R1.1 14.64,70.76 15.41,71.53 15.41,73.58 13.87,75.11
D5*
  Top 0.406: 32U4.31 28.71,47.2 30.13,45.79 32.57,45.79 R6.1
D6*  (via drill 0.8)
  Top 0.406: 32U4.27 25.52,45.41 v23.99,43.89 | HX1.1 9.77,4.46 9.77,9.01 10.45,9.68 18.59,9.68 18.96,10.04 18.96,14.31 22.51,17.86 22.82,18.17 | RK14.2 23.33,18.68 22.82,18.17 | v36.98,24.23 37.07,24.13 37.07,22.54 32.7,18.17 22.82,18.17
  Bottom 0.406: v36.98,24.23 36.98,33.19 29.06,41.11 26.76,41.11 v23.99,43.89
D8*  (via drill 0.8)
  Top 0.305: IC4.3 51.11,34.21 50.84,33.94 49.39,33.94 48.64,33.2 39.93,33.2 v39,32.27
  Top 0.406: 32U4.28 26.32,43.51 v26.37,43.45
  Bottom 0.406: v26.37,43.45 26.37,43.39 27.69,42.07 29.2,42.07 v39,32.27
D9*  (via drill 0.3, 0.8)
  Top 0.305: v38.3,34.64 38.54,34.64 41.23,37.33 41.23,41.62 41.24,41.62 41.24,42.97 42.38,44.12 44.69,44.12 45.41,43.62 v47.66,42.92 | IC4.19 55.66,42.83 v55.43,44.1
  Top 0.406: 32U4.29 27.1,44.75 v28.03,44
  Bottom 0.406: v28.03,44 29.1,43.84 v38.3,34.64 | v55.43,44.1 48.84,44.1 v47.66,42.92
D10*
  Top 0.406: 32U4.30 27.91,46.11 R5.1
D11*
  Top 0.406: 32U4.12 19.71,61.81 17.4,64.12 17.4,65.25 16.43,66.22 16.43,68.06 R1.2
D12*
  Top 0.406: 32U4.26 24.7,46.8 23.99,46.09 11.73,46.09 11.02,45.37 R10.1
D13*
  Top 0.406: 32U4.32 29.5,52 29.5,50.64 30.1,50.05
  Top 0.61: 30.1,50.05 R2.1
GND  (via drill 0.3, 0.4, 0.6, 0.8, 0.8 pad 0.41, 0.8 pad 0.81, 0.9, 0.9 pad 0.61, 0.9 pad 0.81)  (1 unrouted)
  Top 0.305: R36.1 62.9,44.01 63.11,44.22 | IC4.7 53.71,37.93 v53.69,37.96 | C32.2 56.8,28.88 C26.2 R27.1 56.8,23.76 56.84,23.72
  Top 0.406: 22.43,59.39 32U4.15 15.8,59.41 C12.1 | 32U4.5 27.11,61.88 v27.12,61.26 | 32U4.23 22.32,50.91 v21.51,50.1 | 32U4.35 34.24,54.61 v34.66,53.95 | 32U4.43 29.86,61.01 v29.63,60.45 | LDOUT.C 87.96,31.51 v87.96,30.02 | v32.15,63.98 32.84,64.66 C10.2 | U$2.4 26.55,30.97 v26.24,30.66 | LDIN.C 90.09,36.13 v90.09,35.66 | IC4.21 54.36,39.25 v54.35,39.24
  Top 0.5: X4.5 87.54,10.92 v87.81,11.19
  Top 0.61: 22.43,59.39 v22.5,59.42 | CX2.1 7.96,62.86 v10.82,62.83 | BKLD.C 36.43,49.61 v37.71,49.61 | CU9.1 74.44,13.95 v74.07,13.92 | SJ3.2 53.98,64.26 v53.09,63.36 | CU1.2 55.06,70.95 C6.2 57.63,72.58 WGT.4 | RK7.1 35.76,51.98 v37.18,53.4 | SJ2.1 28.88,67.8 v27.83,67.21 | X3.7 X3.8 13.11,78.08 v12.29,78.89 | SJ1.1 9.78,68.45 v9.78,65.93 | C13.1 26.94,76.09 v26.78,76.26 | U1.14 48.12,59.46 v47.74,59.08 | LDPW12.C 31.64,22.43 v32.37,23.01 | LDPW3.C 31.51,24.98 v31.54,25.01 | LDPID.C 31.86,19.95 v32.39,19.68 32.94,20.23 | CU4.2 42.42,18.57 v42.4,19.22 | C2.2 44.77,19.57 v44.69,20.32 | CON_ISP.GND 32.27,77.08 v31.31,77.08 | CX1.1 9.38,52.43 10.12,53.16 10.12,53.13 v9.97,52.98 | U$1.VSS 68.12,66.94 v68.03,67.04
  Top 0.813: C11.2 11.62,65.94 v9.78,65.93
  Top 1.016: 53.81,4.9 53.82,4.91 | Q5.3 75.54,31.34 v74.95,31.92 | Q6.3 75.68,41.02 v74.89,41.82
  Bottom 0.406: v27.12,61.26 27.18,61.82 | v26.24,30.66 25.65,30.66 25.19,30.2 | v90.09,35.66 90.18,35.66 90.18,35.03
  Bottom 0.61: v87.81,11.19 89.47,11.19 | v22.5,59.42 22.9,59.41 23.23,59.07 | 14.79,76.16 14.61,75.98 | 27.18,61.82 27.6,61.4 | v10.82,62.83 10.62,62.85 10.48,62.98 10.22,62.59 | v21.51,50.1 21.51,49.46 21.57,49.4 | v34.66,53.95 34.53,53.42 34.62,53.58 | v29.63,60.45 29.3,59.44 29.71,59.49 | v37.71,49.61 38.15,49 38.15,48.62 | v74.07,13.92 73.8,13.96 73.75,14.01 | v53.09,63.36 53.09,62.45 53.23,62.3 53.23,62.32 | v37.18,53.4 37.18,53.57 36.94,53.82 | v12.29,78.89 12.29,79.16 12.54,79.41 | v26.78,76.26 26.21,76.26 26.16,76.32 | v47.74,59.08 47.32,59.08 47.13,58.89 | v31.54,25.01 31.54,24.59 31.77,24.36 | v32.37,23.01 31.67,22.45 | v32.39,19.68 31.92,20.04 | 66.53,59.5 66.4,59.98 | v42.4,19.22 42.23,24.16 42.36,24.29 | v44.69,20.32 44.8,24.24 44.81,24.26 | v9.97,52.98 9.53,52.98 9.53,52.99 | SJ4.1 SJ5.1 89.13,45.7 89.03,45.6 | v68.03,67.04 67.77,67.04 67.59,67.22
  Bottom 0.813: v9.78,65.93 9.74,64.66 9.85,64.69 | CU8.2 5.44,19.15 IC1.2
  Bottom 1.016: 32.63,19.61 32.59,19.57 | 74.28,42.79 74.45,42.95 74.84,42.95 74.89,42.91 v74.89,41.82 | 72.56,43.1 72.34,42.87 72.34,42.33 | v74.95,31.92 74.95,32.68 74.85,32.79
  other vias: 14.11,1.62 15.29,1.63 12.97,2.05 12.92,3.18 12.89,4.38 12.9,5.52 51.81,39.9 52.43,39.9 53.07,39.91 53.72,39.89 54.38,39.9 55.03,39.89 55.68,39.9 56.32,39.9 51.78,39.25 52.41,39.25 53.04,39.25 53.7,39.24 55,39.23 55.65,39.24 56.3,39.25 51.77,38.61 52.39,38.61 53.03,38.61 53.69,38.6 54.34,38.6 54.99,38.6 55.64,38.6 56.28,38.61 51.77,37.97 52.39,37.97 53.03,37.97 54.34,37.96 54.99,37.95 55.64,37.96 56.28,37.97 51.75,37.32 52.38,37.32 53.01,37.33 53.67,37.32 54.32,37.32 54.97,37.31 55.62,37.32 56.26,37.32 16.47,1.66 16.89,2.84 16.94,4.09 16.92,5.28 16.94,6.42 12.99,7.01 14.33,7.26 15.6,7.2 62.68,43.42 63.02,44.01 62.64,44.62 64.73,43.38 64.42,44.02 63.36,44.6 63.7,44.02 64.03,43.39 63.37,43.41 63.72,39.59 62.93,39.56 62.95,40.29 63.7,40.31 44.58,39.09 43.87,39.1 43.91,39.77 44.6,39.75 58.36,38.67 50.21,38.53 57.77,37.64 57.78,39.6 65.4,43.4 57.75,38.94 57.75,38.28 50.21,39.2 49.56,39.47 50.21,37.87 49.56,38.12 58.36,39.35 49.56,38.79 50.21,39.85 64.12,44.62 58.35,37.98 69.97,43.95 70.89,43.93 70.43,43.16 63.51,53.48 64.21,53.01
  pour Top: 17.18,1.58 17.23,1.58 17.23,7.51 12.61,7.51 12.61,1.4 17.16,1.4 17.16,1.62
  pour Bottom: 4.88,84 72.93,84 73.09,48.51 95.72,48.51 95.55,-1.84 4.67,-1.84 4.67,83.96
  pour Top: 46.29,55.76 71.36,55.26 71.51,19.46 40.65,19.49 40.03,50.13 45.53,55.63
HWB
  Top 0.406: RK7.2 30.34,51.98 32U4.33
ISP+5V  (via drill 0.8)
  Top 0.61: CON_ISP.5V 31.3,73.57 31.3,72.74 31.31,72.73 v31.3,72.64
  Bottom 0.61: 36.37,73.45 D2.A 34.94,72.81 34.05,71.92 32.06,71.92 v31.3,72.64
LGND
  Top 0.5: 46.23,65.14 41.34,65.14 41.21,65.28 40.27,65.28
  Top 0.61: U1.5 45.58,71.79 8.2K.1 | 44.84,72.54 8.2K.1 | 31.04,67.9 31.04,70.66 32.01,71.63 C8.1 35.8,73.17 C7.2 | 31.04,67.9 31.04,66.81 31.23,66.57 35.64,66.57 35.89,66.37 | SJ2.2 30.89,68.05 31.04,67.9 | 46.23,65.14 46.74,65.66 46.74,66.45 45.57,67.62 45.57,69.66 45.66,69.75 | CU2.2 44.39,72.99 8.2K.1
  pour Top: 56.91,76.59 40.54,76.59 35.69,71.73 35.69,61.38 37.39,59.67 60.36,59.67 63.17,62.49 63.17,73.86 60.66,76.37 58.22,76.35 57.89,76.55 57.34,76.53 57.14,76.55 56.95,76.55
MEM_SEL
  Top 0.61: R3.1 64.31,61.84 U$1.CE
MISO  (via drill 0.8, 0.9 pad 0.61)
  Top 0.406: 32U4.11 20.97,63.61 v17.8,66.78 17.8,69.06 17.25,69.61 X3.5 | CON_ISP.MISO 34.73,74.66 35.39,75.33 36.55,75.33 v37.34,76.11 37.58,76.35 37.58,76.9 39.35,78.67 52.27,78.67 52.28,78.66 59.02,78.68 61.32,76.37 61.33,76.36 71.63,76.36 71.92,76.07 71.92,68.66 71.15,67.89 68.76,67.89 68.24,68.41 66.84,68.41 66.62,68.41 65.61,67.41 65.59,66.75 U$1.SO
  Bottom 0.406: v17.8,66.78 17.8,69.06 21,72.26 29.41,72.26 32.54,75.39 36.61,75.39 v37.34,76.11
MOSI  (via drill 0.8, 0.9 pad 0.61)
  Top 0.406: 32U4.10 23.11,64.8 22.31,65.6 21.25,65.6 19.12,67.73 19.12,68.78 | 19.12,68.78 19.12,69.86 18.25,70.73 X3.4 | 20.11,69.78 19.12,68.78
  Top 0.61: v20.42,69.78 20.11,69.78 | 67.62,75.1 61.35,75.1 58.59,77.76 53.22,77.78 53.06,77.78 40.41,77.78 39.28,76.65 39.19,76.56 v39.19,76.53 | CON_ISP.MOSI 31.61,75.93 29.62,73.94 29.62,72.9 | 29.62,72.9 v29.62,71.03 | v28.81,73.66 28.87,73.66 29.62,72.9 | U$1.SI 68.12,74.6 67.62,75.1 | 67.62,75.1 69.84,75.1 RK4.1
  Bottom 0.61: v20.42,69.78 21.58,70.93 22.33,70.93 23.57,69.69 28.44,69.69 29.52,70.77 29.52,70.93 v29.62,71.03 | v39.19,76.53 38.23,77.5 37.01,77.5 36.27,76.76 32.83,76.76 29.73,73.66 v28.81,73.66
N$1
  Top 0.406: 32U4.6 26.32,67.62 27.1,68.4 27.1,70.32
  Top 0.61: 27.1,70.32 C13.2
N$2
  Top 2.184: CON2.P$1 14.3,32.24 16.2,30.34 16.2,19.7 12.77,16.26 12.77,16.18 HX1.2
N$3
  Top 0.61: BKLD.A 34.22,49.72 R2.2
N$5
  Top 0.61: U1.3 48.12,70.43 BJ1.3 48.19,70.71 48.6,71.13 48.6,73.2 48.99,73.59 48.99,74.24 | 48.99,74.24 48.99,74.61 | 48.99,74.61 20K.2 | 48.99,74.61 57.67,74.61 WGT.5 | 48.99,74.24 49.07,74.32 49.07,75.95 48.73,76.29 45.62,76.29 44.21,74.89 CU2.1 39.51,74.89 C7.1
N$7
  Top 0.61: R12.1 27.73,22.46 LDPW12.A
N$8  (via drill 0.8)
  Top 0.406: R5.2 30.55,41.56 v33.53,41.56 | v38.14,36.75 38.76,36.75 40.2,38.19 40.2,46.64 42.54,48.98 42.54,53.38 44.23,55.07 67.24,55.07 68.18,54.13 73.94,54.13 74.9,53.17 74.9,49.95 82.9,41.95 Q6.1 82.9,37.92 84.49,36.33 RK12.2
  Bottom 0.406: v33.53,41.56 33.53,41.35 v38.14,36.75
N$9
  Top 0.406: U$2.1 24.6,32.93 23.56,33.97 23.56,36.89 22.77,37.68 | RT2.2 28.92,36.74 28.28,37.63 28.24,37.68 22.77,37.68 | 11.28,43.47 R10.2 10.92,43.28 12.78,41.42 19.03,41.42 22.77,37.68
N$11  (via drill 0.8)
  Top 0.406: R6.2 34.02,43.42 v35.8,41.64 | RK13.2 85.9,32.06 85.9,29.05 | 85.9,29.05 86.86,28.09 90.14,28.09 91.27,29.22 91.27,37.56 84.63,44.2 84.63,51.75 81.46,54.92 68.57,54.92 67.53,55.96 43.78,55.96 41.61,53.79 41.61,49.48 39.2,47.06 39.2,39.5 v38.51,38.81 | Q5.1 83.62,31.34 85.9,29.05
  Bottom 0.406: v35.8,41.64 35.8,41.6 38.37,39.03 v38.51,38.81
N$12
  Top 0.305: IC4.24 52.41,43.78 C35.2
N$13
  Top 1.016: OUT.2 79.53,29.22 80.33,30.03 80.33,31.29 Q5.2
N$14
  Bottom 0.406: R4.1 25.53,2.16 X1.1
  Bottom 0.61: RT1.1 25.69,5.21 X1.1
N$15
  Top 0.406: RK9.2 46.34,49.23 A-.A 46.32,50.22 A+.C 44.63,50.51
N$17
  Top 1.016: IN.2 79.84,38.88 80.57,39.61 80.57,41.01 Q6.2
N$18
  Top 0.61: RK15.2 19.75,48.32 TX.A
N$19
  Top 0.406: RK11.2 61.84,49.21 | B+.C 61.64,51.03 B-.A 62.07,49.44 RK11.2 | 61.71,49.27 RK11.2
N$20  (via drill 0.9 pad 0.81)
  Top 0.61: RL1.1 34.75,69.77 43,69.77 43.04,69.73 U1.7 43.04,67.23 43.88,66.4 v44.83,66.4
  Bottom 0.61: C9.2 44.34,66.89 v44.83,66.4
N$21
  Top 0.406: 6.48,46.67 R9.2 6.48,44.43 3.83,41.78 3.83,7.75 5.88,5.71 5.88,2.1 7.73,0.48 29.2,0.48 30.31,1.36 30.31,5.23 X1.2
  Bottom 0.61: X1.2 30.19,5.25 RT1.2
N$22
  Top 0.61: LDSLAVE.A 8.8,75.07 RK18.2
N$23  (via drill 0.8)
  Top 0.61: RK3.2 69.26,77.93 v69.46,77.73 | v66.82,69.8 66.85,69.84 U$1.SCK
  Bottom 0.61: v69.46,77.73 66.82,75.09 v66.82,69.8
N$24
  Top 0.61: RXLD.A 24.88,70.52 RK16.2
N$25
  Top 0.61: LDMEM.A 61.84,61.18 RK19.2
N$26
  Top 0.61: RK14.1 27.74,19.85 LDPID.A
N$27
  Top 0.406: RK12.1 LDIN.A
N$28
  Top 0.61: RK13.1 85.74,34.07 LDOUT.A
N$29
  Top 0.305: IC4.23 53.06,46 52.34,46.72 51.66,46.72 C35.1
N$30
  Top 0.305: IC4.22 53.71,46.58 54.83,47.7 55.41,47.7 C34.2
N$34
  Top 0.61: LDPW3.A R14.2
N$35
  Top 0.305: IC4.20 55.01,42.37 54.37,43.05 54.37,45.11 C29.1
N$36
  Top 0.406: IC4.1 49.81,34.92 49.59,34.71 47.46,34.71 R38.2 45.66,35.1 C31.1
N$38
  Top 0.61: U1.2 49.39,69.21 BJ1.1
N$39
  Top 0.61: U1.4 46.85,69.87 8.2K.2 46.87,74.71 20K.1
N$40
  Top 0.406: IC4.14 58.26,35 58.81,34.45 60.02,34.45 R26.2 62.23,35.24 C30.1
N$41
  Top 0.61: RK5.1 49.41,62.79 U1.15 49.39,64.4 50.6,65.61 SJ3.1
N$42
  Top 0.406: 32U4.17 13.82,57.81 X2.P$2
  Top 0.61: 11.45,54.78 12.04,55.37 11.49,55.37 X2.P$2 | RXT.2 9.92,56.94 X2.P$2 | X2.P$2 10.34,54.33 CX1.2
N$43  (via drill 0.9 pad 0.81)
  Top 0.61: RL2.1 40.06,68.41 U1.8 41.77,66.43 v41.89,66.33
  Bottom 0.61: C9.1 42.17,68.73 42.17,66.59 v41.89,66.33
N$44
  Top 0.305: IC4.5 52.42,34.08 52.89,33.61 52.89,31.79 52.25,31.15 R30.1 50.97,31.13 C28.1 R37.2
N$45
  Top 0.305: IC4.6 53.06,34.39 53.49,33.96 53.49,31.25 51.99,29.75 51.99,26.73 R25.2 C25.1
N$46
  Top 0.305: IC4.9 55.01,27.66 C26.1 R27.2
N$47
  Top 0.305: IC4.27 50.46,42.78 50.38,42.86 50,42.86 48.81,44.05 48.81,44.93 R34.1
N$48
  Top 0.406: IC4.17 56.96,44.21 57.54,44.78 58.14,44.78 R33.1
N$49
  Top 0.305: R29.1 54.48,23.98 C27.1 53.71,24.1 | 53.71,24.1 R28.2 | IC4.8 54.36,28.82 53.95,28.4 53.95,24.33 53.71,24.1
N$50
  Top 0.305: IC4.26 51.11,43.17 50.84,43.44 50.29,43.44 49.82,43.91 49.82,46.1 49.43,46.5 R35.2
N$51
  Top 0.305: IC4.12 56.96,34.31 58.18,33.1 58.18,30.77 R31.1 SJ7.2
N$53
  Top 0.305: IC4.13 57.61,34.77 59.02,33.37 59.66,33.37 R32.1 60.25,32.75 SJ8.2
N$54
  Top 0.406: IC4.16 57.61,43.57 57.91,43.87 59.31,43.87 R36.2
RESET  (via drill 0.8, 0.8 pad 0.81)
  Top 0.406: 32U4.13 19.05,61.01 16.43,63.63 16.43,64.75 15.13,66.05 15.12,66.04 C11.1
  Top 0.61: v13.67,72.01 12.49,70.86 RK6.1 11.35,70.86 SJ1.2 11.43,68.43 13.38,68.43 14.15,67.55 C11.1 | 37.15,79.36 37.15,79.23 | 37.15,79.36 v37.17,79.37 | CON_ISP.RESET 35,77.2 37.15,79.36
  Bottom 0.61: v13.67,72.01 19.15,77.52 20.3,77.52 22.57,79.79 36.75,79.79 v37.17,79.37
RX  (via drill 0.8, 0.9 pad 0.61)
  Top 0.406: 32U4.20 20.48,55.38 17.04,55.38 16.48,54.82 16.48,52.58 15.88,51.98 v15.88,48.61 | v15.97,43.06 15.99,42.91 20.37,42.91 24.62,38.76 36.36,38.74 38.4,40.78 38.4,47.45 40.56,49.61 40.56,54.26 v41.99,55.68 | 70.27,56.97 v70.3,56.94 68.95,56.94 68.2,57.69 54.67,57.69 v54.14,58.22
  Bottom 0.406: 15.91,48.57 v15.97,43.06 | v54.14,58.22 53.06,58.24 51.53,58.24 49.33,60.44 46.75,60.44 v41.99,55.68 | v70.3,56.94 75.79,56.94 U$3.P$6
  Bottom 0.61: v15.88,48.61 15.91,48.57
RXLED
  Top 0.406: 32U4.8 24.71,66.72
  Top 0.61: 24.71,66.72 RXLD.C
SCK  (via drill 0.8 pad 0.81, 0.9 pad 0.61)
  Top 0.406: 32U4.9 23.91,65.54 21.26,68.19 21.26,68.71 21.87,69.32 21.87,70.25 19.25,72.87 19.25,76.84 | X3.3 19.25,76.84 | 20.79,75.29 19.25,76.84
  Top 0.61: v20.84,75.29 20.79,75.29 | v29.79,76.35 29.77,78.48 32.01,80.69 39.52,80.69 | 39.52,80.69 58.39,80.69 | 58.39,80.69 58.51,80.69 | 39.52,80.69 39.11,80.28 39.11,79.63 35.64,76.16 33.89,76.16 CON_ISP.SCK | RK3.1 61.15,77.93 58.39,80.69
  Bottom 0.61: v29.79,76.35 29.68,76.2 28.26,74.79 21.35,74.79 v20.84,75.29
SCL  (via drill 0.8 pad 0.81)
  Top 0.406: RK2.2 11.6,53.08 11.8,53.29 13.07,53.29 14.37,54.59 14.37,56.11 15.27,57.01 32U4.18 20.53,57.01 21.69,57.01 22.52,57.85 v23.57,57.85
  Top 0.61: J2.SCL 66.05,4.96 67.2,6.13 71.73,6.13 J1.SCL
  Bottom 0.61: J2.SCL 56.85,4.96 58.66,6.76 58.66,7.9 55.81,10.74 55.81,16.29 41.77,30.33 41.77,39.45 23.57,57.66 v23.57,57.85
SDA  (via drill 0.8 pad 0.81)
  Top 0.406: RK1.2 15.4,53.09 15.4,55.48 16.13,56.21 32U4.19 20.53,56.23 v23.03,56.23
  Top 0.61: J1.SDA 71.88,8.15 71.06,8.97 61.89,8.97 59.15,6.23 55.95,6.23 J2.SDA
  Bottom 0.61: J2.SDA 54.71,7.52 54.71,15.69 40.53,29.88 40.53,38.98 23.28,56.23 v23.03,56.23
TX  (via drill 0.8, 0.9 pad 0.61)
  Top 0.406: 32U4.21 20.48,54.57 17.89,54.57 17.36,54.04 v17.36,49.84 | v17.34,44.33 17.36,44.31 21.26,44.31 25.84,39.73 35.96,39.73 37.45,41.21 37.45,47.71 39.77,50.04 39.77,55.2 v39.93,55.35 | v69.41,58.49 57.33,58.49 56.38,59.64 56.38,59.59 v56.36,59.58
  Bottom 0.406: 17.34,49.83 v17.34,44.33 | v39.93,55.35 45.92,61.34 50.98,61.34 52.74,59.58 v56.36,59.58 | U$3.P$7 71.22,58.23 70.94,58.51 69.56,58.51 69.47,58.6 69.48,58.5 v69.41,58.49
  Bottom 0.61: v17.36,49.84 17.34,49.83
TXLED
  Top 0.406: 32U4.22 19.93,53.81 19.63,53.51 19.63,52.68
  Top 0.61: 19.63,52.68 TX.C
USB_N  (via drill 0.3)
  Top 0.406: v29.12,65.52 28.71,65.12 32U4.3 | v85.94,44.31 86.02,44.38 88.35,42.04 91.8,42.04 93.33,40.51 93.33,27.27 89.46,23.39 86.59,23.39 85.54,22.34 85.54,18.8 RUSB1.1
  Bottom 0.406: v29.12,65.52 29.36,65.76 32.8,65.76 33.63,64.93 33.63,60.56 35.84,58.35 40.65,58.35 40.65,60.13 43.71,63.2 47.93,63.2 50,65.27 53.34,65.27 65.97,52.63 65.97,48.01 69.04,44.94 85.45,44.94 86.02,44.38 v85.94,44.31
USB_P  (via drill 0.3)
  Top 0.406: 87.78,17.92 RUSB2.1 86.2,18.73 86.2,22.07 86.87,22.74 89.73,22.74 93.99,27 93.99,40.78 92.07,42.7 88.62,42.7 86.48,44.84 v86.55,44.91 | v27.93,65.68 27.93,63.62 32U4.4
  Bottom 0.406: v27.93,65.68 28.66,66.42 33.07,66.42 34.29,65.2 34.29,60.83 36.12,59 39.99,59 39.99,60.41 43.44,63.85 47.66,63.85 49.84,66.04 53.5,66.04 66.84,52.69 66.84,48.07 69.31,45.6 85.73,45.6 86.48,44.84 v86.55,44.91
USBC_N
  Top 0.406: X4.2 85.11,8.01 85.11,13.42 84.16,14.37 RUSB1.2
USBC_P
  Top 0.406: X4.3 85.91,7.97 85.91,13.39 87.47,14.95 RUSB2.2
VDD  (via drill 0.8)
  Top 0.406: 22.99,22.46 20.22,22.46 v20.19,22.49
  Top 0.61: X3.2 X3.1 20.33,78.99 v20.33,80.09 | R12.2 22.99,22.46
  Bottom 0.61: D2.C 40.99,74.43 CU3.1 40.62,78.55 C1.1 arc50 38.53,80.68 20.93,80.68 v20.33,80.09 19.9,80.52 9.16,80.52 8.34,79.71 8.34,38.62 4.7,34.98 4.7,28.17 9.43,23.44 10.22,23.44 11.79,21.87 11.79,21.64 | IC1.1 10.62,16.83 11.79,18 11.79,21.64 | D4.C 41.22,14.94 34.94,21.22 21.46,21.22 v20.19,22.49 12.64,22.49 11.79,21.64
  Bottom 0.813: D1.C 11.3,13.4 CU7.1 9.3,16.84 IC1.1
VUSB  (via drill 0.8, 0.8 pad 0.81)
  Top 0.406: 32U4.7 25.52,60.49 26.02,59.98 26.02,57.43 v28.76,55.88 | v59.35,13.85 60.45,12.68
  Top 0.5: X4.1 84.34,9.71 80.13,13.92 79.06,13.92 CU9.2
  Top 0.61: v48.74,13.73 48.76,13.53 49.61,12.68 60.45,12.68 72.1,12.68 72.46,13.04 72.46,14.71 73.58,15.83 77.74,15.83 78.32,15.27 CU9.2
  Bottom 0.406: v28.76,55.88 29.02,55.23 29.07,55.23 42.99,41.31 42.99,30.7 59.35,14.34 v59.35,13.85
  Bottom 0.61: D4.A 47.94,14.93 v48.74,13.73
XTAL1
  Top 0.406: 32U4.16 13.48,58.61
  Top 0.61: 13.48,58.61 X2.P$1 | X2.P$1 6.97,60.65 CX2.2 | RXT.1 9.62,58.84 X2.P$1

### Text on the board
tPlace: - | +
tNames: SPI | D11 | MEM SELECT | Rx | IF LoRa | BLK | OPT | 3V3 | VDD | PID | D12
bNames: LoRa RN2483
tValues: Screen | BerthaV4.5 | PhA1 | PhA2 | PhB1 | PhB2 | PID | OUT | IN | IN | PUMPS | D10 | OUT | 3V3 | D5 | 12V | PID | BerthaV4.5 | PID
203bmp: C:/Users/G/Pictures/logo_epfl.bmp